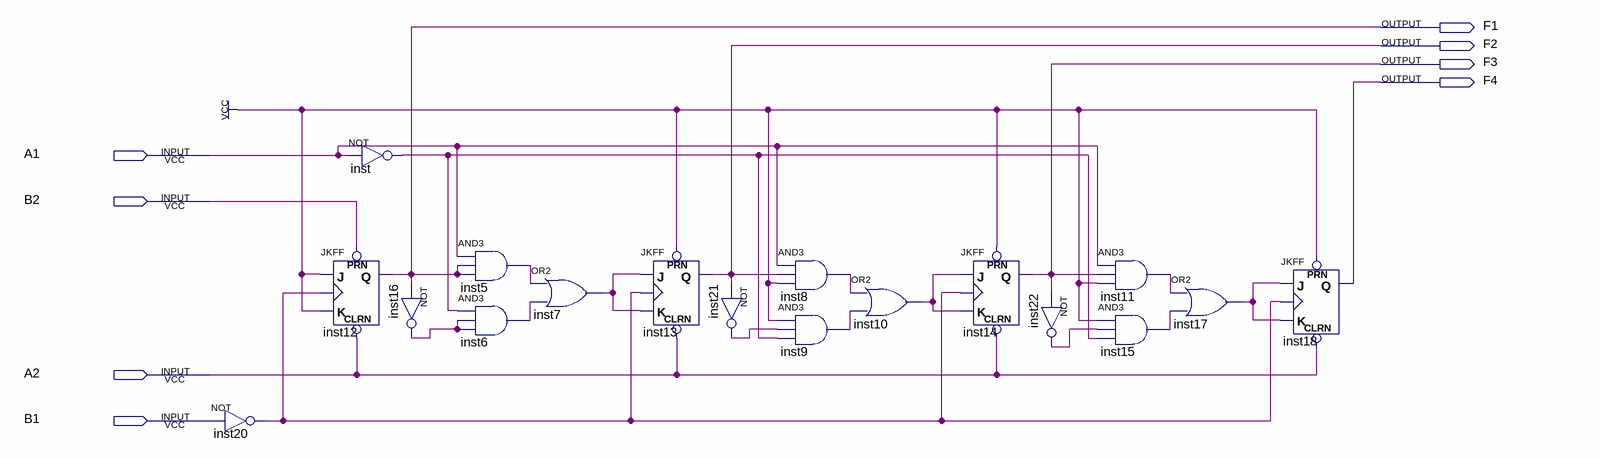
[diagram p0: schematic sheet]
// Quartus schematic SyncUpDown.bdf as structural Verilog: 18 symbols, 8 pins
module SyncUpDown (
  input  A1,
  input  B2,
  input  A2,
  input  B1,
  output F1,
  output F2,
  output F3,
  output F4
);

  wire inst5_out, inst6_out, inst7_out, inst8_out, inst9_out, inst10_out, inst11_out, inst15_out, inst16_out,
       inst17_out, inst20_out, inst21_out, inst22_out, inst_out;

  not inst20 (inst20_out, B1);
  JKFF inst12 (.PRN(B2), .CLRN(A2), .K(1'b1), .J(1'b1), .CLK(inst20_out), .Q(F1));
  not inst (inst_out, A1);
  not inst16 (inst16_out, F1);
  and inst5 (inst5_out, A1, F1, F1);
  and inst6 (inst6_out, inst_out, inst16_out, inst16_out);
  or inst7 (inst7_out, inst5_out, inst6_out);
  JKFF inst13 (.PRN(1'b1), .CLRN(A2), .K(inst7_out), .J(inst7_out), .CLK(inst20_out), .Q(F2));
  not inst21 (inst21_out, F2);
  and inst8 (inst8_out, A1, F2, 1'b1);
  and inst9 (inst9_out, 1'b1, inst21_out, inst_out);
  or inst10 (inst10_out, inst8_out, inst9_out);
  JKFF inst14 (.PRN(1'b1), .CLRN(A2), .K(inst10_out), .J(inst10_out), .CLK(inst20_out), .Q(F3));
  not inst22 (inst22_out, F3);
  and inst11 (inst11_out, A1, F3, 1'b1);
  and inst15 (inst15_out, 1'b1, inst22_out, inst_out);
  or inst17 (inst17_out, inst11_out, inst15_out);
  JKFF inst18 (.PRN(1'b1), .CLRN(A2), .K(inst17_out), .J(inst17_out), .CLK(inst20_out), .Q(F4));
endmodule
